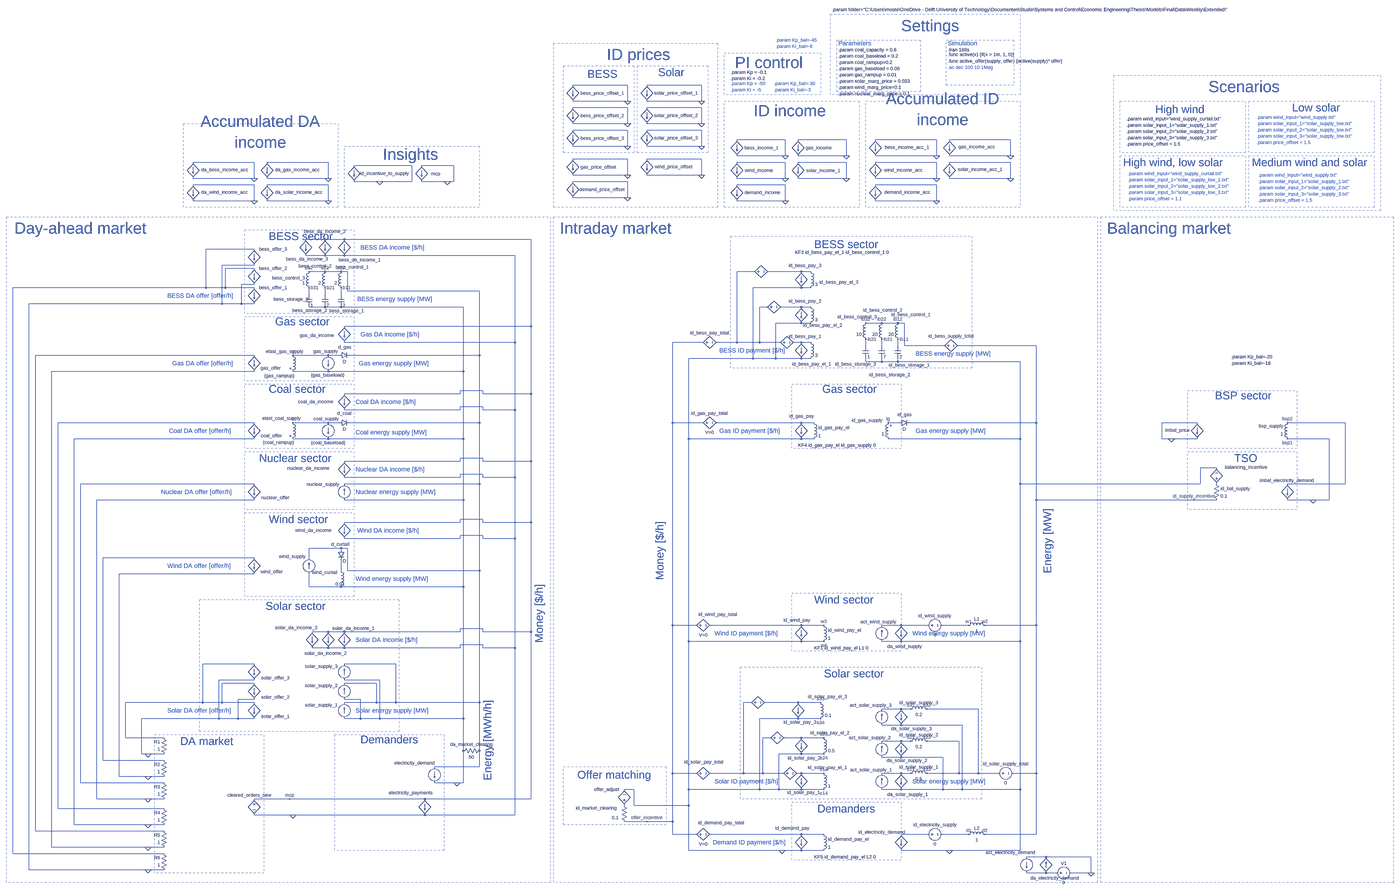
[diagram p0: schematic extended_week_sector.asc, whole sheet]
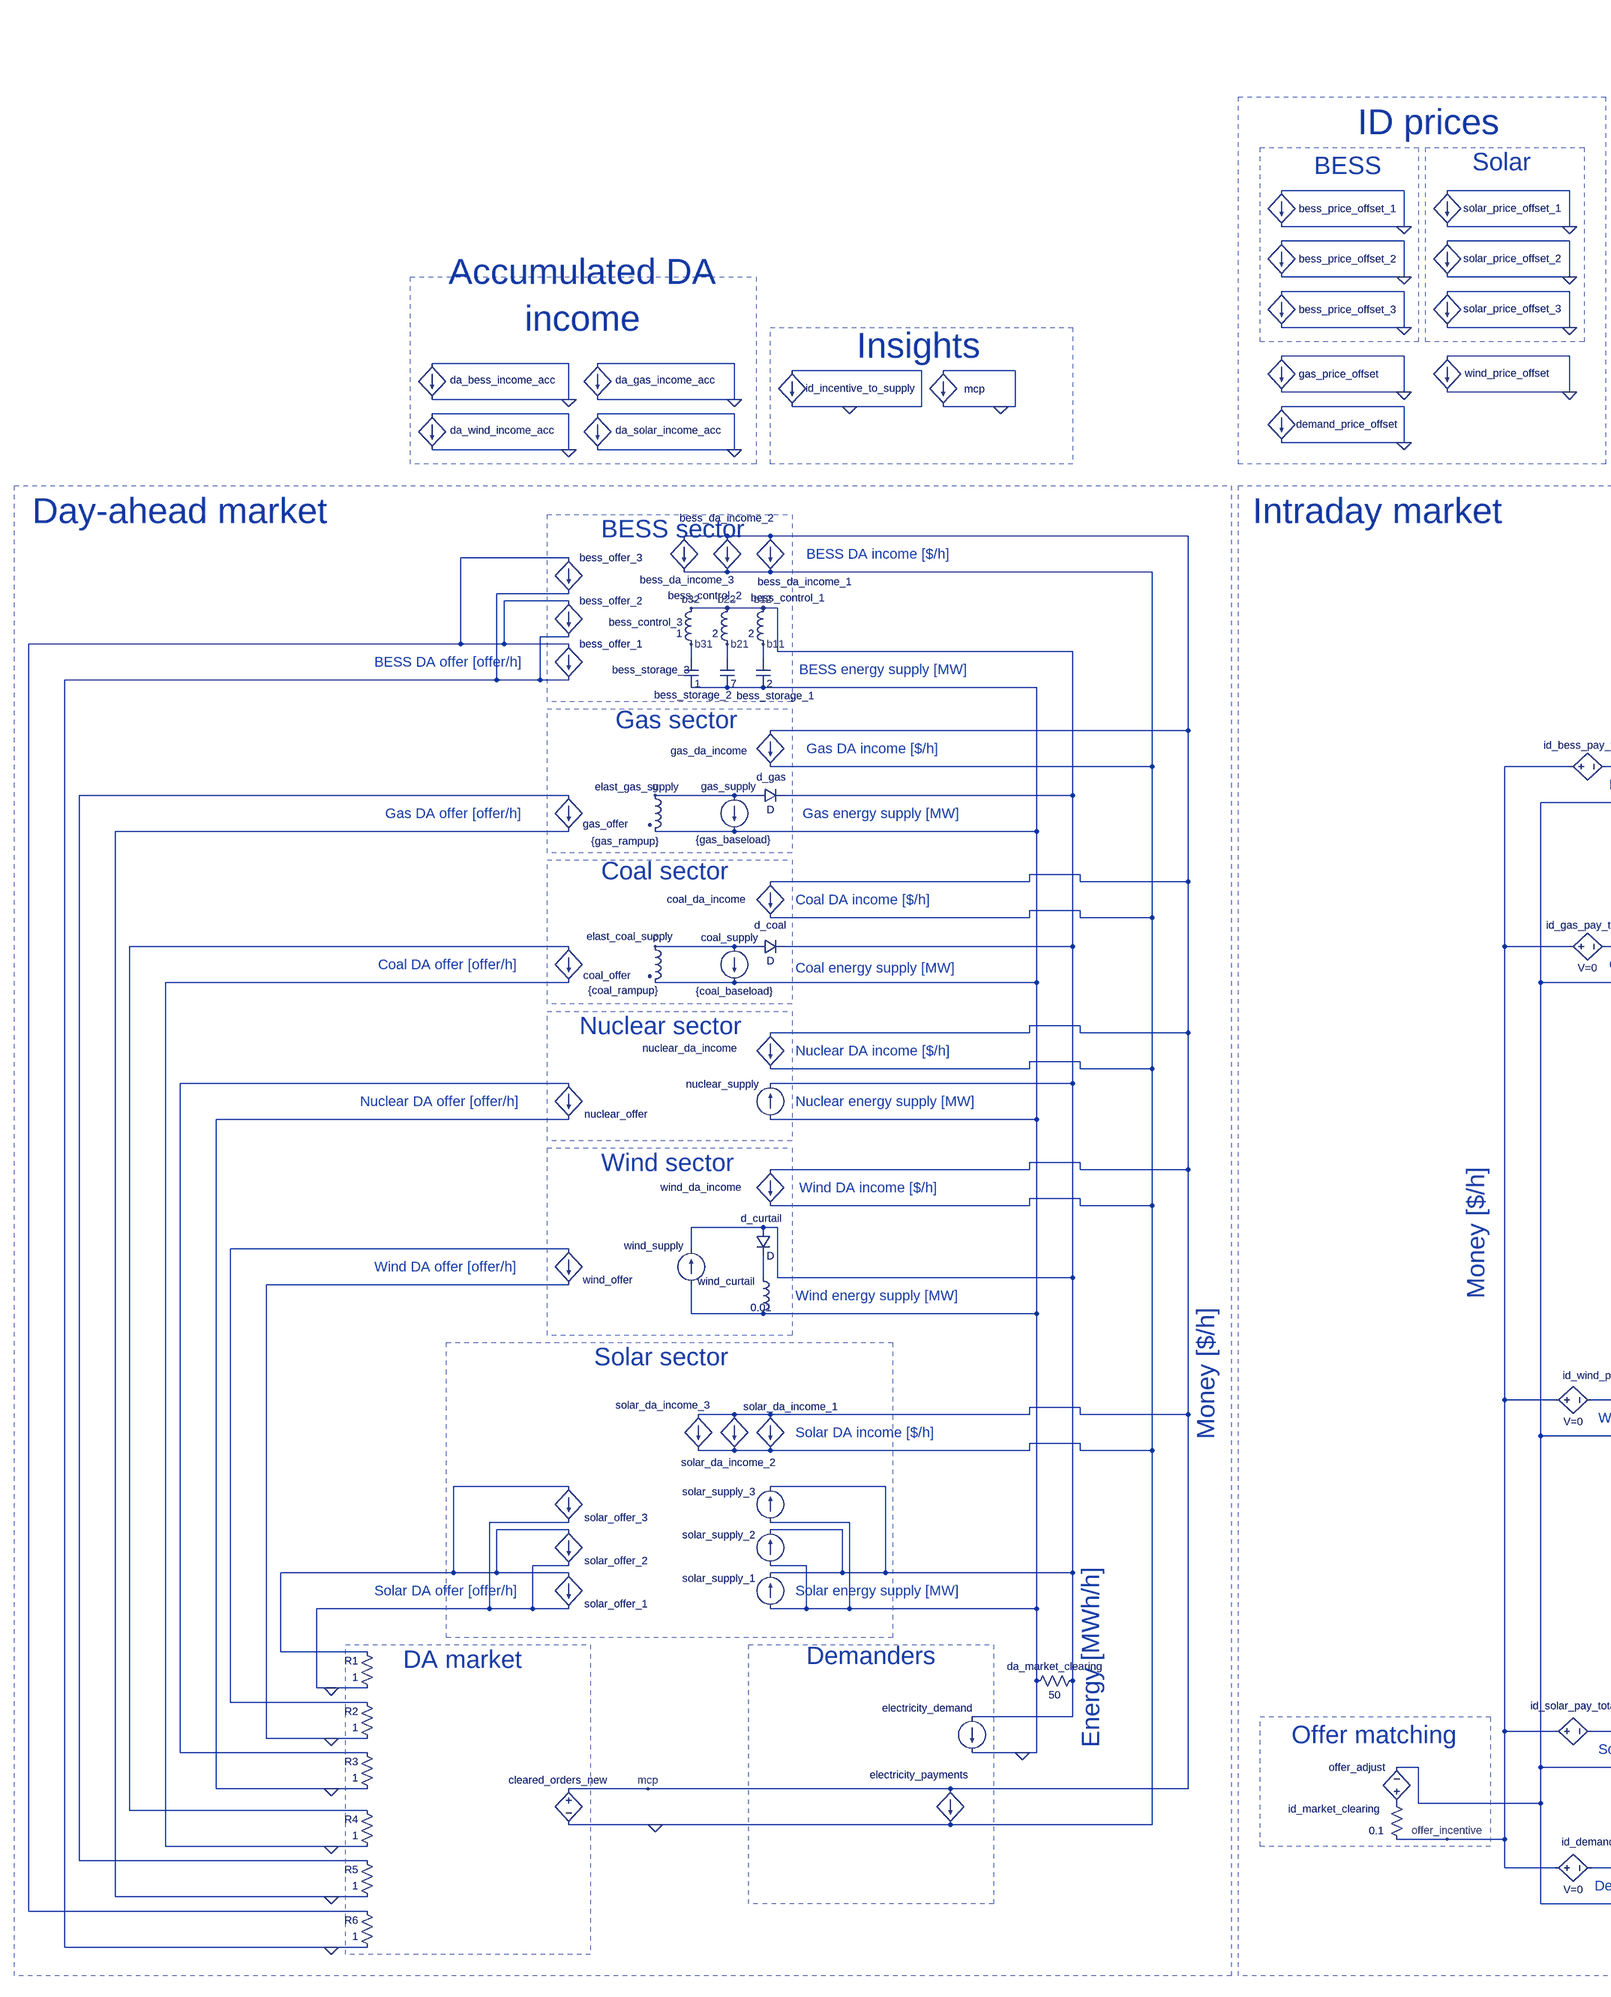
[diagram p1: schematic extended_week_sector.asc, part, row 1 of 1, column 1 of 2]
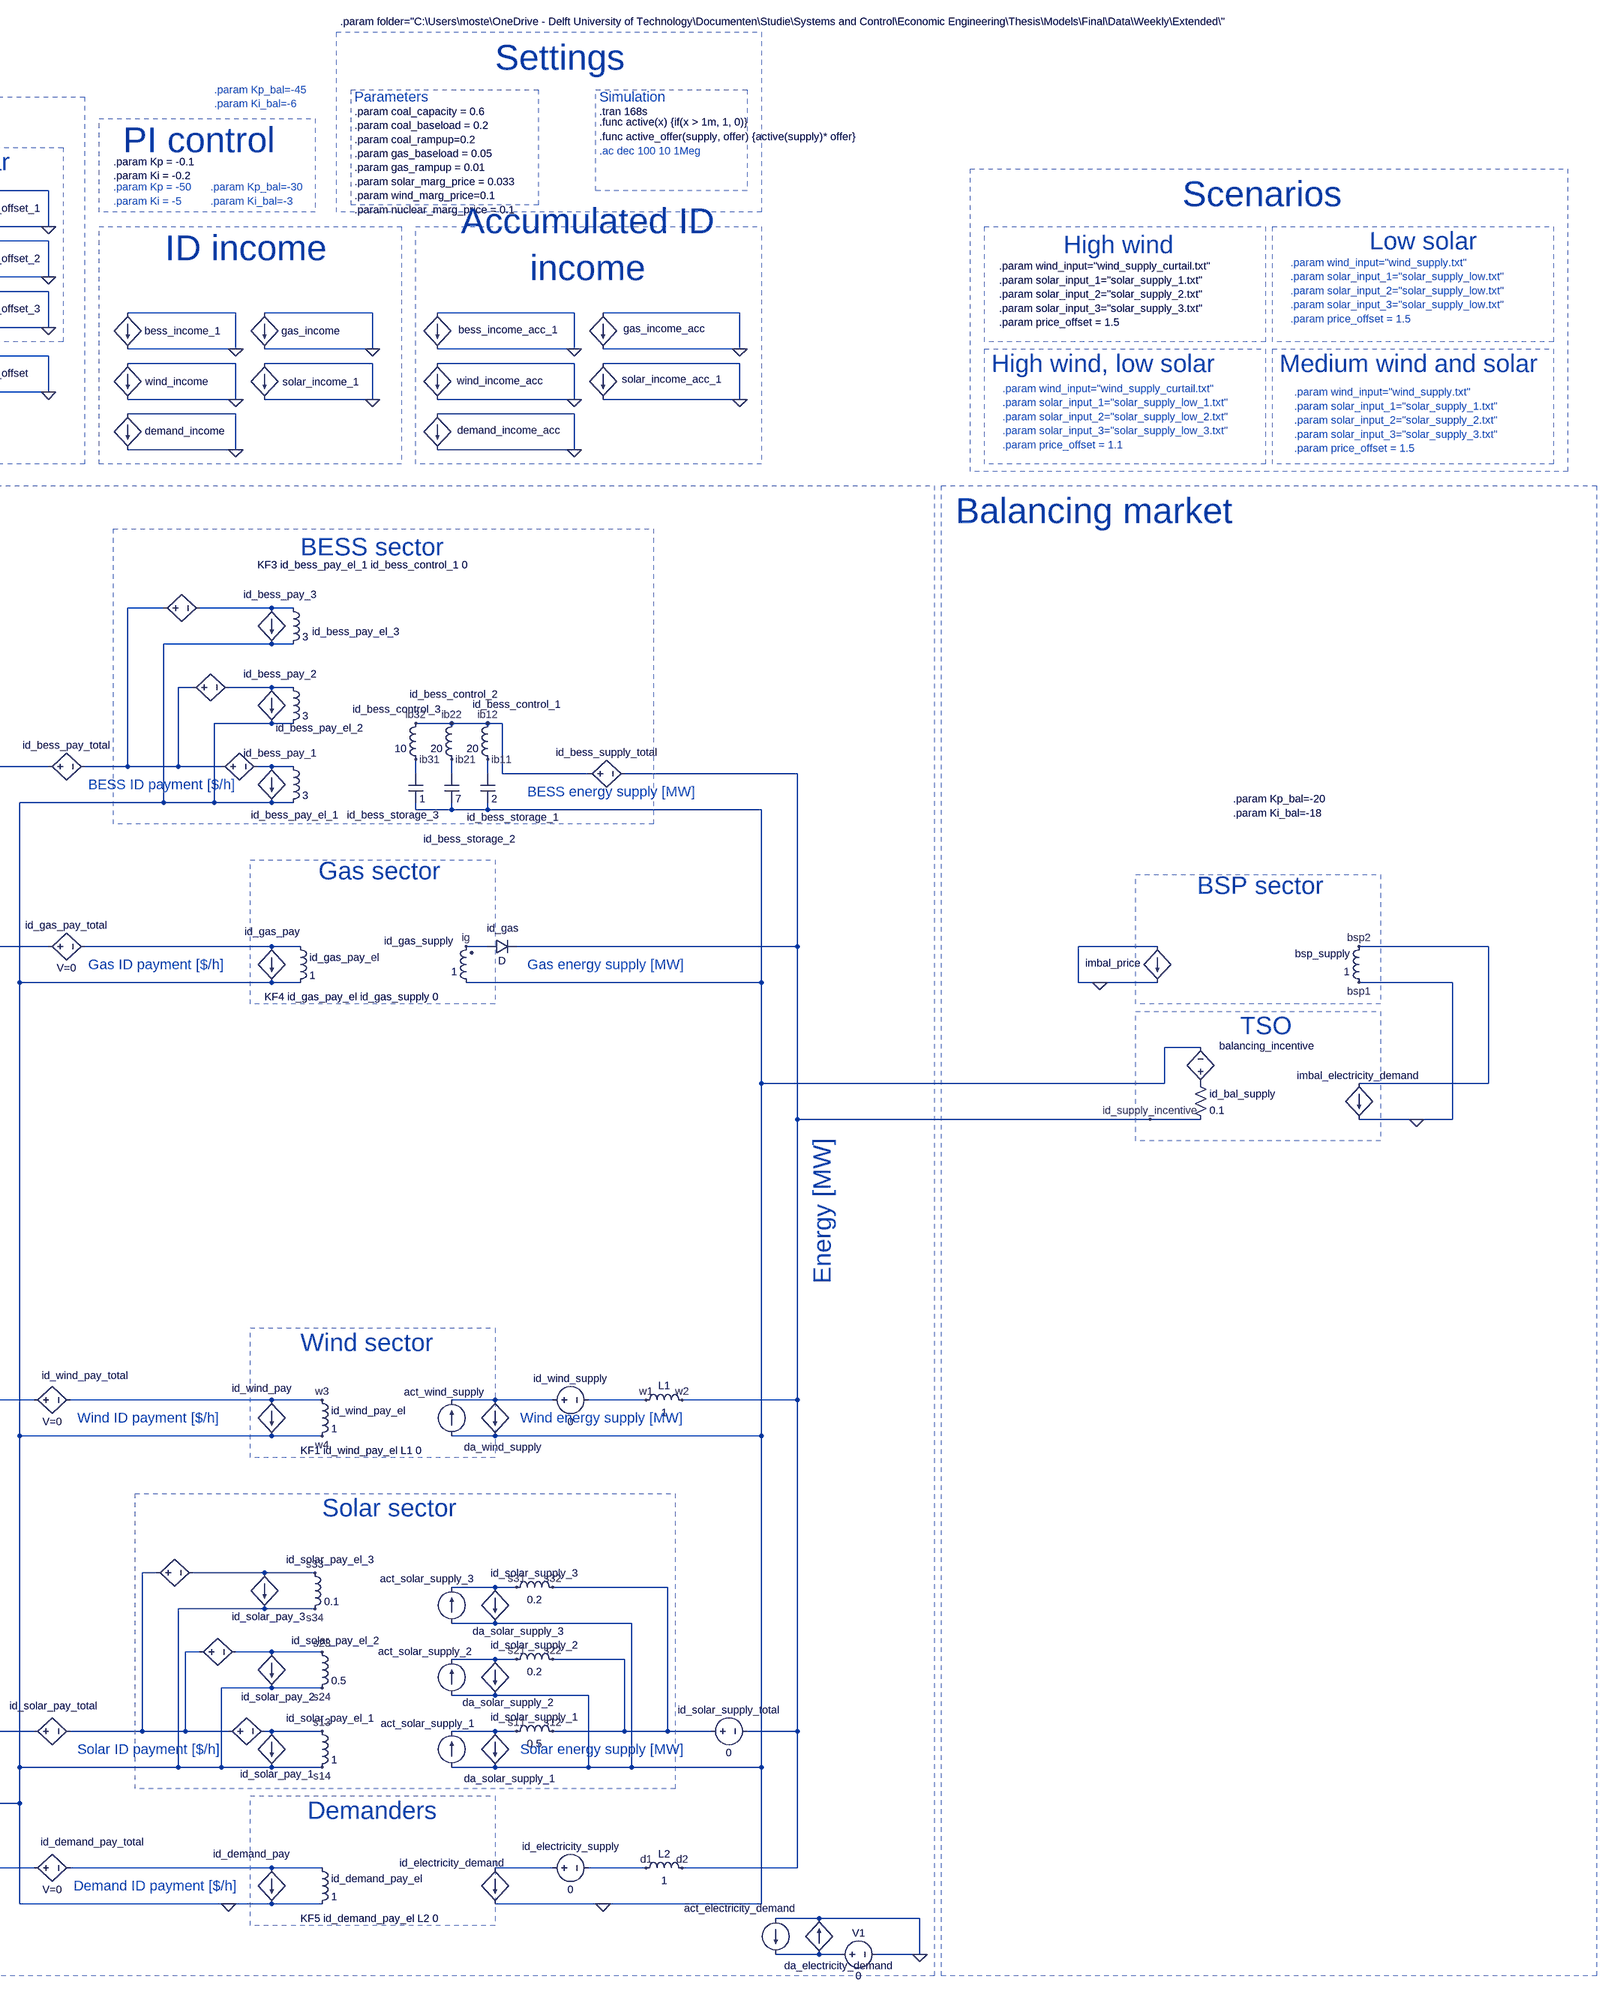
[diagram p2: schematic extended_week_sector.asc, part, row 1 of 1, column 2 of 2]
* extended_week_sector.asc
L§wind_curtail N011 0 0.01
d_curtail b32 N011 D
I§solar_supply_1 0 b32 PWL file={folder+solar_input_1}
I§wind_supply 0 b32 PWL file={folder+ wind_input}
I§nuclear_supply 0 b32 PWL file="C:\Users\moste\OneDrive - Delft University of Technology\Documenten\Studie\Systems and Control\Economic Engineering\Thesis\Models\Final\Data\Weekly\nuclear_supply.txt"
I§coal_supply c 0 {coal_baseload}
L§elast_coal_supply c 0 {coal_rampup} Rser=1u
d_coal c b32 D
I§gas_supply g 0 {gas_baseload}
L§elast_gas_supply g 0 {gas_rampup} Rser=1u
d_gas g b32 D
I§electricity_demand b32 0 PWL file="C:\Users\moste\OneDrive - Delft University of Technology\Documenten\Studie\Systems and Control\Economic Engineering\Thesis\Models\Final\Data\Weekly\electricity_demand_extended_increased.txt"
B§gas_offer N006 0 I=I(d_gas)*{gas_rampup}*50
B§coal_offer N007 0 I=I(d_coal)*{coal_rampup}*2.5
B§nuclear_offer N009 0 I=active_offer(I(nuclear_supply), {nuclear_marg_price})
B§wind_offer N010 0 I=active_offer(I(wind_supply), -{wind_marg_price})
B§solar_offer_1 N013 0 I=active_offer(I(solar_supply_1), -{solar_marg_price})
R1 0 N013 1
R2 0 N010 1
R3 0 N009 1
R4 0 N007 1
R5 0 N006 1
B§gas_da_income mcp 0 I=V(mcp)*I(d_gas)
B§coal_da_income mcp 0 I=V(mcp)*I(d_coal)
B§nuclear_da_income mcp 0 I=V(mcp)*I(nuclear_supply)
B§wind_da_income mcp 0 I=V(mcp)*I(wind_supply)
B§solar_da_income_1 mcp 0 I=V(mcp)*I(solar_supply_1)
B§cleared_orders_new mcp 0 V = if( (I(R4)<1e-6) + (I(R5)<1e-6) > 1,min(I(R1), I(R2)),max(I(R4), I(R5)) )
B§electricity_payments mcp 0 I=V(mcp)*I(electricity_demand)
L§bess_control_1 b11 b32 2
C§bess_storage_1 b11 0 2
bess_offer_1 N001 0 I=idt(V(b11)-V(b12))
R6 0 N001 1
B§mcp 0 0 I=I(electricity_payments)/I(electricity_demand)
bess_da_income_1 mcp 0 I=V(mcp)*I(bess_control_1)
L§id_gas_supply 0 ig 1 Rser=1u
B§id_gas_pay N008 0 I=10*idt(- V(ig))*I(id_gas)
R§id_bal_supply P001 d2 0.1
L§id_bess_control_1 ib11 ib32 20
C§id_bess_storage_1 ib11 0 2
B§id_bess_pay_1 N005 0 I=(idt(V(ib11)-V(ib12)))*I(id_bess_control_1)
I§act_wind_supply 0 N012 PWL file="C:\Users\moste\OneDrive - Delft University of Technology\Documenten\Studie\Systems and Control\Economic Engineering\Thesis\Models\Final\Data\Weekly\act_wind_supply_curtail.txt"
I§act_solar_supply_1 0 s11 PWL file="C:\Users\moste\OneDrive - Delft University of Technology\Documenten\Studie\Systems and Control\Economic Engineering\Thesis\Models\Final\Data\Weekly\Extended\act_solar_supply.txt"
B§da_wind_supply N012 0 I=I(wind_supply)
I§act_electricity_demand 0 N017 PWL file="C:\Users\moste\OneDrive - Delft University of Technology\Documenten\Studie\Systems and Control\Economic Engineering\Thesis\Models\Final\Data\Weekly\Extended\act_electricity_demand_extended_increased.txt"
B§id_electricity_demand N016 0 I=I(act_electricity_demand)-I(electricity_demand)
B§id_incentive_to_supply 0 0 I=-V(id_supply_incentive)
D§id_gas ig d2 D
L1 w1 d2 1 Rser=0.1
L§id_solar_supply_1 s11 s32 0.5 Rser=0.1
B§id_solar_pay_1 s13 0 I=idt(V(s11)-V(s12))*I(id_solar_supply_1)
B§id_wind_pay w3 0 I=idt(V(w1)-V(w2))*I(id_wind_supply)
L§id_wind_pay_el w3 0 1 Rser=0.1
L§id_solar_pay_el_1 s13 0 1 Rser=0.1
R§id_market_clearing P002 offer_incentive 0.1
B§id_wind_pay_total offer_incentive w3 V=0
B§id_solar_pay_net_1 N014 s13 V=0
L§id_bess_pay_el_1 N005 0 3 Rser=0.1
B§id_bess_pay_net_1 N002 N005 V=0
L§id_gas_pay_el N008 0 1 Rser=0.1
B§id_gas_pay_total offer_incentive N008 V=0
L2 d1 d2 1 Rser=0.1
L§id_demand_pay_el N015 0 1 Rser=0.1
B§id_demand_pay N015 0 I=idt(V(d1)-V(d2))*I(id_electricity_supply)
B§id_demand_pay_total offer_incentive N015 V=0
balancing_incentive P001 0 V={Kp_bal}*I(id_bal_supply)+{Ki_bal}*idt(I(id_bal_supply))
B§wind_price_offset 0 0 I=(I(id_wind_pay_total)+{price_offset})/(I(id_wind_supply)+{price_offset})
B§solar_price_offset_1 0 0 I=(I(id_solar_pay_net_1)+{price_offset})/(I(id_solar_supply_1)+{price_offset})
bess_price_offset_1 0 0 I=(I(id_bess_pay_net_1)+{price_offset})/(I(id_bess_control_1)+{price_offset})
B§demand_price_offset 0 0 I=(I(id_demand_pay_total)+{price_offset})/(I(id_electricity_supply)+{price_offset})
V§id_wind_supply N012 w1 0
B§da_electricity_demand N017 0 I=I(electricity_demand)
B§da_solar_supply_1 s11 0 I=I(solar_supply_1)
V1 N017 0 0
V§id_electricity_supply N016 d1 0
bess_income_1 0 0 I=I(id_bess_control_1)*I(bess_price_offset_1)
B§wind_income 0 0 I=I(id_wind_supply)*I(wind_price_offset)
B§solar_income_1 0 0 I=I(id_solar_supply_1)*I(solar_price_offset_1)
B§demand_income 0 0 I=I(id_electricity_supply)*I(demand_price_offset)
bess_income_acc_1 0 0 I=idt(I(bess_income_1))
B§wind_income_acc 0 0 I=idt(I(wind_income))
B§solar_income_acc_1 0 0 I=idt(I(solar_income_1))
B§demand_income_acc 0 0 I=idt(I(demand_income))
B§gas_price_offset 0 0 I=(I(id_gas_pay_total)+{price_offset})/(I(id_gas)+{price_offset})
B§gas_income 0 0 I=I(id_gas)*I(gas_price_offset)
B§gas_income_acc 0 0 I=idt(I(gas_income))
B§offer_adjust P002 0 V={Kp}*I(id_market_clearing)+{Ki}*idt(I(id_market_clearing))
B§imbal_electricity_demand bsp2 0 I=I(id_bal_supply)
L§bsp_supply 0 bsp2 1
B§imbal_price 0 0 I=idt(V(bsp1)-V(bsp2))*10
B§da_bess_income_acc 0 0 I=idt(I(bess_da_income_1))
B§da_gas_income_acc 0 0 I=idt(I(gas_da_income))
B§da_wind_income_acc 0 0 I=idt(I(wind_da_income))
B§da_solar_income_acc 0 0 I=idt(I(solar_da_income_1))
L§id_bess_control_2 ib21 ib32 20
C§id_bess_storage_2 ib21 0 7
L§id_bess_control_3 ib31 ib32 10
C§id_bess_storage_3 ib31 0 1
B§id_bess_supply_total ib32 d2 V=0
B§id_bess_pay_2 N004 0 I=(idt(V(ib21)-V(ib22)))*I(id_bess_control_2)
L§id_bess_pay_el_2 N004 0 3 Rser=0.1
B§id_bess_pay_3 N003 0 I=(idt(V(ib31)-V(ib32)))*I(id_bess_control_3)
L§id_bess_pay_el_3 N003 0 3 Rser=0.1
B§id_bess_pay_net_2 N002 N004 V=0
B§id_bess_pay_net_3 N002 N003 V=0
B§id_bess_pay_total offer_incentive N002 V=0
bess_price_offset_2 0 0 I=(I(id_bess_pay_net_2)+{price_offset})/(I(id_bess_control_2)+{price_offset})
bess_price_offset_3 0 0 I=(I(id_bess_pay_net_3)+{price_offset})/(I(id_bess_control_3)+{price_offset})
I§solar_supply_2 0 b32 PWL file={folder+solar_input_2}
I§solar_supply_3 0 b32 PWL file={folder+solar_input_3}
B§solar_offer_2 N013 0 I=active_offer(I(solar_supply_2), -{solar_marg_price})
B§solar_offer_3 N013 0 I=active_offer(I(solar_supply_3), -{solar_marg_price})
B§solar_da_income_2 mcp 0 I=V(mcp)*I(solar_supply_2)
B§solar_da_income_3 mcp 0 I=V(mcp)*I(solar_supply_3)
I§act_solar_supply_2 0 s21 PWL file="C:\Users\moste\OneDrive - Delft University of Technology\Documenten\Studie\Systems and Control\Economic Engineering\Thesis\Models\Final\Data\Weekly\Extended\act_solar_supply.txt"
B§da_solar_supply_2 s21 0 I=I(solar_supply_2)
I§act_solar_supply_3 0 s31 PWL file="C:\Users\moste\OneDrive - Delft University of Technology\Documenten\Studie\Systems and Control\Economic Engineering\Thesis\Models\Final\Data\Weekly\Extended\act_solar_supply.txt"
B§da_solar_supply_3 s31 0 I=I(solar_supply_3)
L§id_solar_supply_2 s21 s32 0.2 Rser=0.1
L§id_solar_supply_3 s31 s32 0.2 Rser=0.1
B§id_solar_pay_2 s23 0 I=idt(V(s21)-V(s22))*I(id_solar_supply_2)
L§id_solar_pay_el_2 s23 0 0.5 Rser=0.1
B§id_solar_pay_3 s33 0 I=idt(V(s31)-V(s32))*I(id_solar_supply_3)
L§id_solar_pay_el_3 s33 0 0.1 Rser=0.1
B§id_solar_pay_net_2 N014 s23 V=0
B§id_solar_pay_net_3 N014 s33 V=0
V§id_solar_supply_total s32 d2 0
B§id_solar_pay_total offer_incentive N014 V=0
B§solar_price_offset_2 0 0 I=(I(id_solar_pay_net_2)+{price_offset})/(I(id_solar_supply_2)+{price_offset})
B§solar_price_offset_3 0 0 I=(I(id_solar_pay_net_3)+{price_offset})/(I(id_solar_supply_3)+{price_offset})
R§da_market_clearing b32 0 50
L§bess_control_2 b21 b32 2
C§bess_storage_2 b21 0 7
L§bess_control_3 b31 b32 1
C§bess_storage_3 b31 0 1
bess_offer_2 N001 0 I=idt(V(b21)-V(b22))
bess_offer_3 N001 0 I=idt(V(b31)-V(b32))
bess_da_income_2 mcp 0 I=V(mcp)*I(bess_control_2)
bess_da_income_3 mcp 0 I=V(mcp)*I(bess_control_3)
.model D D
.lib standard.dio
* Solar energy supply [MW]
* Solar sector
* Wind sector
* Nuclear sector
* Wind energy supply [MW]
* Nuclear energy supply [MW]
* Coal sector
* Gas sector
* Coal energy supply [MW]
* Gas energy supply [MW]
* Settings
.param coal_capacity = 0.6
.param coal_baseload = 0.2
.param coal_rampup=0.2
.param gas_baseload = 0.05
.param gas_rampup = 0.01
.param solar_marg_price = 0.033
.param wind_marg_price=0.1
.param nuclear_marg_price = 0.1
* Parameters
.tran 168s
* Simulation
* Demanders
* Energy [MWh/h]
* DA market
.func active(x) {if(x > 1m, 1, 0)}
.func active_offer(supply, offer) {active(supply)* offer}
* Solar DA income [$/h]
* Wind DA income [$/h]
* Nuclear DA income [$/h]
* Coal DA income [$/h]
* Gas DA income [$/h]
* Gas DA offer [offer/h]
* Coal DA offer [offer/h]
* Nuclear DA offer [offer/h]
* Wind DA offer [offer/h]
* Solar DA offer [offer/h]
* Money [$/h]
.param wind_input="wind_supply_curtail.txt"
.param solar_input_1="solar_supply_1.txt"
.param solar_input_2="solar_supply_2.txt"
.param solar_input_3="solar_supply_3.txt"
.param price_offset = 1.5
.param folder="C:\Users\moste\OneDrive - Delft University of Technology\Documenten\Studie\Systems and Control\Economic Engineering\Thesis\Models\Final\Data\Weekly\Extended\"
* High wind
* .param wind_input="wind_supply.txt"
* .param solar_input_1="solar_supply_low.txt"
* .param solar_input_2="solar_supply_low.txt"
* .param solar_input_3="solar_supply_low.txt"
* .param price_offset = 1.5
* Low solar
* Scenarios
* BESS sector
* Insights
* Day-ahead market
* Solar energy supply [MW]
* Solar sector
* Wind sector
* Wind energy supply [MW]
* Gas sector
* Gas energy supply [MW]
* Energy [MW]
* Gas ID payment [$/h]
* Wind ID payment [$/h]
* Solar ID payment [$/h]
* Money [$/h]
* BESS sector
* Intraday market
KF1 id_wind_pay_el L1 0
* BESS ID payment [$/h]
* .param wind_input="wind_supply_curtail.txt"
* .param solar_input_1="solar_supply_low_1.txt"
* .param solar_input_2="solar_supply_low_2.txt"
* .param solar_input_3="solar_supply_low_3.txt"
* .param price_offset = 1.1
* High wind, low solar
* BESS energy supply [MW]
* PI control
KF3 id_bess_pay_el_1 id_bess_control_1 0
KF4 id_gas_pay_el id_gas_supply 0
KF5 id_demand_pay_el L2 0
* Demanders
* .param Kp_bal=-30
* .param Ki_bal=-3
* Demand ID payment [$/h]
* Balancing market
* Offer matching
* ID prices
* ID income
* Accumulated ID
* income
.param Kp_bal=-20
.param Ki_bal=-18
* TSO
* BSP sector
* .param wind_input="wind_supply.txt"
* .param solar_input_1="solar_supply_1.txt"
* .param solar_input_2="solar_supply_2.txt"
* .param solar_input_3="solar_supply_3.txt"
* .param price_offset = 1.5
* Medium wind and solar
* .param Kp = -50
* .param Ki = -5
* Accumulated DA
* income
* BESS energy supply [MW]
* BESS DA income [$/h]
* BESS DA offer [offer/h]
* BESS
* Solar
* .ac dec 100 10 1Meg
* .param Kp_bal=-45
* .param Ki_bal=-6
.param Kp = -0.1
.param Ki = -0.2
.backanno
.end